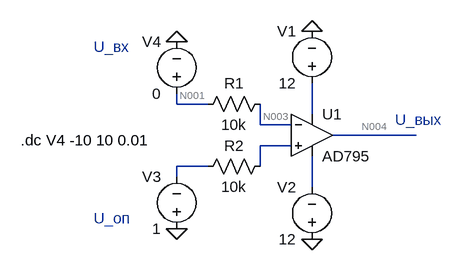
[diagram p0: schematic task31.asc]
task31.asc, the LTspice schematic file:
Version 4.1
SHEET 1 880 680
WIRE 0 112 0 96
WIRE 48 112 0 112
WIRE 208 128 208 80
WIRE 128 144 128 112
WIRE 176 144 128 144
WIRE 368 160 240 160
WIRE 176 176 128 176
WIRE 48 208 0 208
WIRE 128 208 128 176
WIRE 0 224 0 208
WIRE 208 240 208 192
FLAG 208 320 0
FLAG 208 0 0
FLAG 0 16 0
FLAG 0 304 0
SYMBOL OpAmps\\AD795 208 96 R0
SYMATTR InstName U1
SYMBOL voltage 208 96 R180
WINDOW 0 24 96 Left 2
WINDOW 3 24 16 Left 2
SYMATTR InstName V1
SYMATTR Value 12
SYMBOL res 144 96 R90
WINDOW 0 0 56 VBottom 2
WINDOW 3 32 56 VTop 2
SYMATTR InstName R1
SYMATTR Value 10k
SYMBOL res 144 192 R90
WINDOW 0 0 56 VBottom 2
WINDOW 3 32 56 VTop 2
SYMATTR InstName R2
SYMATTR Value 10k
SYMBOL voltage 0 112 R180
WINDOW 0 24 96 Left 2
WINDOW 3 24 16 Left 2
SYMATTR InstName V4
SYMATTR Value 0
SYMBOL voltage 208 336 R180
WINDOW 0 24 96 Left 2
WINDOW 3 24 16 Left 2
SYMATTR InstName V2
SYMATTR Value 12
SYMBOL voltage 0 320 R180
WINDOW 0 24 96 Left 2
WINDOW 3 24 16 Left 2
SYMATTR InstName V3
SYMATTR Value 1
TEXT -240 168 Left 2 !.dc V4 -10 10 0.01
TEXT -128 24 Left 2 ;U_вх
TEXT -128 288 Left 2 ;U_оп
TEXT 336 136 Left 2 ;U_вых

The netlist it stands for:
* task31.asc
X§U1 N005 N003 N002 N007 N004 AD795  ; pins In+ In- V+ V- OUT
V1 N002 0 12
R1 N003 N001 10k
R2 N005 N006 10k
V4 N001 0 0
V2 0 N007 12
V3 0 N006 1
.dc V4 -10 10 0.01
* U_вх
* U_оп
* U_вых
.lib ADI1.lib
.backanno
.end

* Results of the author's LTspice run, read from the files saved beside the schematic
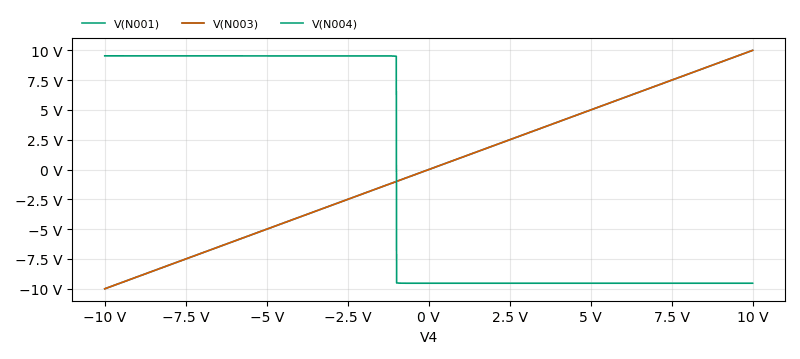
[diagram p1: DC transfer characteristic of task31.asc, plotted from the saved traces]
* DC transfer characteristic, 1 run:
*   V(N001): -10 V at V4=-10 V, 10 V at V4=10 V, min -10 V, max 10 V
*   V(N003): -10 V at V4=-10 V, 10 V at V4=10 V, min -10 V, max 10 V
*   V(N004): 9.54 V at V4=-10 V, -9.532 V at V4=10 V, min -9.532 V, max 9.54 V